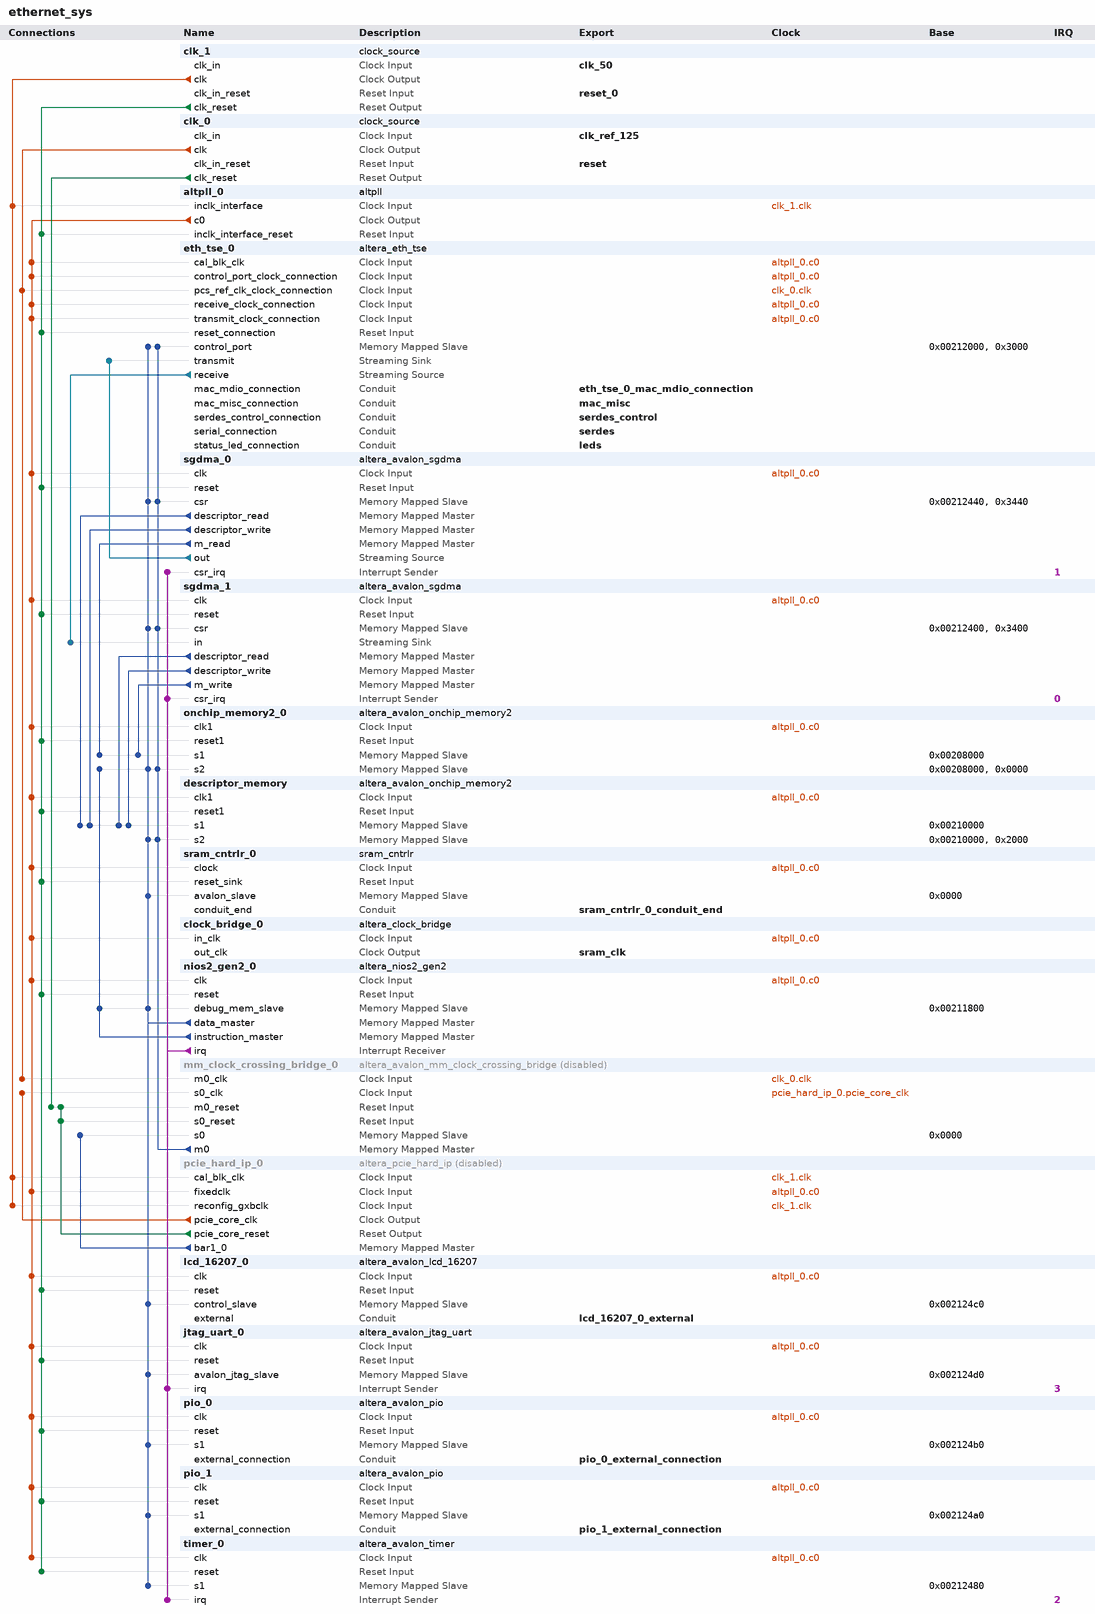
[diagram p0: system contents]
# Platform Designer (Qsys) system ethernet_sys, Cyclone IV GX EP4CGX15BF14C6
# Parameters at their usual value, and those the tool derives, are not listed.
package require -exact qsys 18.1
create_system ethernet_sys
set_project_property DEVICE_FAMILY {Cyclone IV GX}
set_project_property DEVICE EP4CGX15BF14C6

add_instance clk_1 clock_source 18.1
set_instance_parameter_value clk_1 clockFrequency 50000000

add_instance clk_0 clock_source 18.1
set_instance_parameter_value clk_0 clockFrequency 125000000

add_instance altpll_0 altpll 18.1
set_instance_parameter_value altpll_0 CLK0_DIVIDE_BY 1
set_instance_parameter_value altpll_0 CLK0_MULTIPLY_BY 2
set_instance_parameter_value altpll_0 INCLK0_INPUT_FREQUENCY 20000
set_instance_parameter_value altpll_0 PORT_ARESET PORT_UNUSED
set_instance_parameter_value altpll_0 PORT_LOCKED PORT_USED
set_instance_parameter_value altpll_0 PORT_clk1 PORT_UNUSED
set_instance_parameter_value altpll_0 PORT_clk2 PORT_UNUSED
set_instance_parameter_value altpll_0 PORT_clk3 PORT_UNUSED

add_instance eth_tse_0 altera_eth_tse 18.1
set_instance_parameter_value eth_tse_0 XCVR_RCFG_JTAG_ENABLE 0
set_instance_parameter_value eth_tse_0 XCVR_SET_CAPABILITY_REG_ENABLE 0
set_instance_parameter_value eth_tse_0 XCVR_SET_CSR_SOFT_LOGIC_ENABLE 0
set_instance_parameter_value eth_tse_0 XCVR_SET_PRBS_SOFT_LOGIC_ENABLE 0
set_instance_parameter_value eth_tse_0 XCVR_SET_USER_IDENTIFIER 0
set_instance_parameter_value eth_tse_0 core_variation MAC_PCS
set_instance_parameter_value eth_tse_0 eg_addr 9
set_instance_parameter_value eth_tse_0 enable_hd_logic false
set_instance_parameter_value eth_tse_0 enable_mac_flow_ctrl false
set_instance_parameter_value eth_tse_0 enable_magic_detect false
set_instance_parameter_value eth_tse_0 enable_shift16 true
set_instance_parameter_value eth_tse_0 ifGMII MII_GMII
set_instance_parameter_value eth_tse_0 ing_addr 11
set_instance_parameter_value eth_tse_0 mdio_clk_div 40
set_instance_parameter_value eth_tse_0 stat_cnt_ena false
set_instance_parameter_value eth_tse_0 transceiver_type GXB

add_instance sgdma_0 altera_avalon_sgdma 18.1
set_instance_parameter_value sgdma_0 enableBurstTransfers false
set_instance_parameter_value sgdma_0 enableUnalignedTransfers false
set_instance_parameter_value sgdma_0 readBlockDataWidth 32
set_instance_parameter_value sgdma_0 sinkErrorWidth 0
set_instance_parameter_value sgdma_0 sourceErrorWidth 0
set_instance_parameter_value sgdma_0 transferMode MEMORY_TO_STREAM
set_instance_parameter_value sgdma_0 writeBurstcountWidth 4

add_instance sgdma_1 altera_avalon_sgdma 18.1
set_instance_parameter_value sgdma_1 enableBurstTransfers false
set_instance_parameter_value sgdma_1 enableUnalignedTransfers false
set_instance_parameter_value sgdma_1 readBlockDataWidth 32
set_instance_parameter_value sgdma_1 sinkErrorWidth 0
set_instance_parameter_value sgdma_1 sourceErrorWidth 0
set_instance_parameter_value sgdma_1 transferMode STREAM_TO_MEMORY
set_instance_parameter_value sgdma_1 writeBurstcountWidth 4

add_instance onchip_memory2_0 altera_avalon_onchip_memory2 18.1
set_instance_parameter_value onchip_memory2_0 dataWidth 32
set_instance_parameter_value onchip_memory2_0 dualPort true
set_instance_parameter_value onchip_memory2_0 initMemContent true
set_instance_parameter_value onchip_memory2_0 initializationFileName C:/projects/quartus/ethernet/software/zhopen/mem_init/ethernet_sys_onchip_memory2_0.hex
set_instance_parameter_value onchip_memory2_0 memorySize 32768
set_instance_parameter_value onchip_memory2_0 singleClockOperation true
set_instance_parameter_value onchip_memory2_0 useNonDefaultInitFile true

add_instance descriptor_memory altera_avalon_onchip_memory2 18.1
set_instance_parameter_value descriptor_memory dataWidth 32
set_instance_parameter_value descriptor_memory dualPort true
set_instance_parameter_value descriptor_memory initMemContent true
set_instance_parameter_value descriptor_memory initializationFileName C:/projects/quartus/ethernet/software/zhopen/mem_init/ethernet_sys_descriptor_memory.hex
set_instance_parameter_value descriptor_memory memorySize 4096
set_instance_parameter_value descriptor_memory singleClockOperation true
set_instance_parameter_value descriptor_memory useNonDefaultInitFile true

add_instance sram_cntrlr_0 sram_cntrlr 1.0

add_instance clock_bridge_0 altera_clock_bridge 18.1
set_instance_parameter_value clock_bridge_0 DERIVED_CLOCK_RATE 100000000
set_instance_parameter_value clock_bridge_0 EXPLICIT_CLOCK_RATE 0

add_instance nios2_gen2_0 altera_nios2_gen2 18.1
set_instance_parameter_value nios2_gen2_0 dcache_size 2048
set_instance_parameter_value nios2_gen2_0 exceptionSlave onchip_memory2_0.s2
set_instance_parameter_value nios2_gen2_0 icache_size 4096
set_instance_parameter_value nios2_gen2_0 impl Tiny
set_instance_parameter_value nios2_gen2_0 resetSlave onchip_memory2_0.s2

add_instance mm_clock_crossing_bridge_0 altera_avalon_mm_clock_crossing_bridge 18.1
set_instance_property mm_clock_crossing_bridge_0 ENABLED false
set_instance_parameter_value mm_clock_crossing_bridge_0 ADDRESS_WIDTH 10
set_instance_parameter_value mm_clock_crossing_bridge_0 COMMAND_FIFO_DEPTH 4
set_instance_parameter_value mm_clock_crossing_bridge_0 DATA_WIDTH 32
set_instance_parameter_value mm_clock_crossing_bridge_0 MASTER_SYNC_DEPTH 2
set_instance_parameter_value mm_clock_crossing_bridge_0 MAX_BURST_SIZE 1
set_instance_parameter_value mm_clock_crossing_bridge_0 RESPONSE_FIFO_DEPTH 4
set_instance_parameter_value mm_clock_crossing_bridge_0 SLAVE_SYNC_DEPTH 2
set_instance_parameter_value mm_clock_crossing_bridge_0 USE_AUTO_ADDRESS_WIDTH 1

add_instance pcie_hard_ip_0 altera_pcie_hard_ip 18.1
set_instance_property pcie_hard_ip_0 ENABLED false
set_instance_parameter_value pcie_hard_ip_0 {BAR Type} {64 bit Prefetchable,Not used,Not used,Not used,Not used,Not used}
set_instance_parameter_value pcie_hard_ip_0 CB_A2P_ADDR_MAP_PASS_THRU_BITS 20
set_instance_parameter_value pcie_hard_ip_0 CB_PCIE_MODE 1
set_instance_parameter_value pcie_hard_ip_0 CB_PCIE_RX_LITE 1
set_instance_parameter_value pcie_hard_ip_0 CG_ENABLE_A2P_INTERRUPT 0
set_instance_parameter_value pcie_hard_ip_0 CG_IMPL_CRA_AV_SLAVE_PORT 0
set_instance_parameter_value pcie_hard_ip_0 CG_NO_CPL_REORDERING 0
set_instance_parameter_value pcie_hard_ip_0 {PCIe Address 31:0} 0x00000000,0x00000000,0x00000000,0x00000000,0x00000000,0x00000000,0x00000000,0x00000000,0x00000000,0x00000000,0x00000000,0x00000000,0x00000000,0x00000000,0x00000000,0x00000000
set_instance_parameter_value pcie_hard_ip_0 {PCIe Address 63:32} 0x00000000,0x00000000,0x00000000,0x00000000,0x00000000,0x00000000,0x00000000,0x00000000,0x00000000,0x00000000,0x00000000,0x00000000,0x00000000,0x00000000,0x00000000,0x00000000
set_instance_parameter_value pcie_hard_ip_0 class_code 16711680
set_instance_parameter_value pcie_hard_ip_0 device_id 2
set_instance_parameter_value pcie_hard_ip_0 my_advanced_errors false
set_instance_parameter_value pcie_hard_ip_0 my_enable_ecrc_check false
set_instance_parameter_value pcie_hard_ip_0 my_enable_ecrc_gen false
set_instance_parameter_value pcie_hard_ip_0 p_pcie_app_clk 1
set_instance_parameter_value pcie_hard_ip_0 p_pcie_target_performance_preset Medium
set_instance_parameter_value pcie_hard_ip_0 p_pcie_test_out_width None
set_instance_parameter_value pcie_hard_ip_0 p_pcie_txrx_clock {125 MHz}
set_instance_parameter_value pcie_hard_ip_0 p_user_msi_enable 0
set_instance_parameter_value pcie_hard_ip_0 revision_id 105
set_instance_parameter_value pcie_hard_ip_0 subsystem_device_id 2
set_instance_parameter_value pcie_hard_ip_0 subsystem_vendor_id 5827
set_instance_parameter_value pcie_hard_ip_0 vendor_id 5827

add_instance lcd_16207_0 altera_avalon_lcd_16207 18.1

add_instance jtag_uart_0 altera_avalon_jtag_uart 18.1
set_instance_parameter_value jtag_uart_0 simInteractiveOptions NO_INTERACTIVE_WINDOWS
set_instance_parameter_value jtag_uart_0 useRegistersForReadBuffer true
set_instance_parameter_value jtag_uart_0 useRegistersForWriteBuffer true

add_instance pio_0 altera_avalon_pio 18.1
set_instance_parameter_value pio_0 direction Input
set_instance_parameter_value pio_0 width 8

add_instance pio_1 altera_avalon_pio 18.1
set_instance_parameter_value pio_1 direction Output
set_instance_parameter_value pio_1 width 3

add_instance timer_0 altera_avalon_timer 18.1
set_instance_parameter_value timer_0 period 30
set_instance_parameter_value timer_0 periodUnits USEC

# connections
add_connection altpll_0.c0 clock_bridge_0.in_clk clock
add_connection altpll_0.c0 descriptor_memory.clk1 clock
add_connection altpll_0.c0 eth_tse_0.cal_blk_clk clock
add_connection altpll_0.c0 eth_tse_0.control_port_clock_connection clock
add_connection altpll_0.c0 eth_tse_0.receive_clock_connection clock
add_connection altpll_0.c0 eth_tse_0.transmit_clock_connection clock
add_connection altpll_0.c0 jtag_uart_0.clk clock
add_connection altpll_0.c0 lcd_16207_0.clk clock
add_connection altpll_0.c0 nios2_gen2_0.clk clock
add_connection altpll_0.c0 onchip_memory2_0.clk1 clock
add_connection altpll_0.c0 pcie_hard_ip_0.fixedclk clock
add_connection altpll_0.c0 pio_0.clk clock
add_connection altpll_0.c0 pio_1.clk clock
add_connection altpll_0.c0 sgdma_0.clk clock
add_connection altpll_0.c0 sgdma_1.clk clock
add_connection altpll_0.c0 sram_cntrlr_0.clock clock
add_connection altpll_0.c0 timer_0.clk clock
add_connection clk_0.clk eth_tse_0.pcs_ref_clk_clock_connection clock
add_connection clk_0.clk mm_clock_crossing_bridge_0.m0_clk clock
add_connection clk_1.clk altpll_0.inclk_interface clock
add_connection clk_1.clk pcie_hard_ip_0.cal_blk_clk clock
add_connection clk_1.clk pcie_hard_ip_0.reconfig_gxbclk clock
add_connection pcie_hard_ip_0.pcie_core_clk mm_clock_crossing_bridge_0.s0_clk clock
add_connection clk_0.clk_reset mm_clock_crossing_bridge_0.m0_reset reset
add_connection clk_1.clk_reset altpll_0.inclk_interface_reset reset
add_connection clk_1.clk_reset descriptor_memory.reset1 reset
add_connection clk_1.clk_reset eth_tse_0.reset_connection reset
add_connection clk_1.clk_reset jtag_uart_0.reset reset
add_connection clk_1.clk_reset lcd_16207_0.reset reset
add_connection clk_1.clk_reset nios2_gen2_0.reset reset
add_connection clk_1.clk_reset onchip_memory2_0.reset1 reset
add_connection clk_1.clk_reset pio_0.reset reset
add_connection clk_1.clk_reset pio_1.reset reset
add_connection clk_1.clk_reset sgdma_0.reset reset
add_connection clk_1.clk_reset sgdma_1.reset reset
add_connection clk_1.clk_reset sram_cntrlr_0.reset_sink reset
add_connection clk_1.clk_reset timer_0.reset reset
add_connection pcie_hard_ip_0.pcie_core_reset mm_clock_crossing_bridge_0.m0_reset reset
add_connection pcie_hard_ip_0.pcie_core_reset mm_clock_crossing_bridge_0.s0_reset reset
add_connection mm_clock_crossing_bridge_0.m0 descriptor_memory.s2 avalon
set_connection_parameter_value mm_clock_crossing_bridge_0.m0/descriptor_memory.s2 baseAddress 0x2000
add_connection mm_clock_crossing_bridge_0.m0 eth_tse_0.control_port avalon
set_connection_parameter_value mm_clock_crossing_bridge_0.m0/eth_tse_0.control_port baseAddress 0x3000
add_connection mm_clock_crossing_bridge_0.m0 onchip_memory2_0.s2 avalon
set_connection_parameter_value mm_clock_crossing_bridge_0.m0/onchip_memory2_0.s2 baseAddress 0x0000
add_connection mm_clock_crossing_bridge_0.m0 sgdma_0.csr avalon
set_connection_parameter_value mm_clock_crossing_bridge_0.m0/sgdma_0.csr baseAddress 0x3440
add_connection mm_clock_crossing_bridge_0.m0 sgdma_1.csr avalon
set_connection_parameter_value mm_clock_crossing_bridge_0.m0/sgdma_1.csr baseAddress 0x3400
add_connection nios2_gen2_0.data_master descriptor_memory.s2 avalon
set_connection_parameter_value nios2_gen2_0.data_master/descriptor_memory.s2 baseAddress 0x00210000
add_connection nios2_gen2_0.data_master eth_tse_0.control_port avalon
set_connection_parameter_value nios2_gen2_0.data_master/eth_tse_0.control_port baseAddress 0x00212000
add_connection nios2_gen2_0.data_master jtag_uart_0.avalon_jtag_slave avalon
set_connection_parameter_value nios2_gen2_0.data_master/jtag_uart_0.avalon_jtag_slave baseAddress 0x002124d0
add_connection nios2_gen2_0.data_master lcd_16207_0.control_slave avalon
set_connection_parameter_value nios2_gen2_0.data_master/lcd_16207_0.control_slave baseAddress 0x002124c0
add_connection nios2_gen2_0.data_master nios2_gen2_0.debug_mem_slave avalon
set_connection_parameter_value nios2_gen2_0.data_master/nios2_gen2_0.debug_mem_slave baseAddress 0x00211800
add_connection nios2_gen2_0.data_master onchip_memory2_0.s2 avalon
set_connection_parameter_value nios2_gen2_0.data_master/onchip_memory2_0.s2 baseAddress 0x00208000
add_connection nios2_gen2_0.data_master pio_0.s1 avalon
set_connection_parameter_value nios2_gen2_0.data_master/pio_0.s1 baseAddress 0x002124b0
add_connection nios2_gen2_0.data_master pio_1.s1 avalon
set_connection_parameter_value nios2_gen2_0.data_master/pio_1.s1 baseAddress 0x002124a0
add_connection nios2_gen2_0.data_master sgdma_0.csr avalon
set_connection_parameter_value nios2_gen2_0.data_master/sgdma_0.csr baseAddress 0x00212440
add_connection nios2_gen2_0.data_master sgdma_1.csr avalon
set_connection_parameter_value nios2_gen2_0.data_master/sgdma_1.csr baseAddress 0x00212400
add_connection nios2_gen2_0.data_master sram_cntrlr_0.avalon_slave avalon
set_connection_parameter_value nios2_gen2_0.data_master/sram_cntrlr_0.avalon_slave baseAddress 0x0000
add_connection nios2_gen2_0.data_master timer_0.s1 avalon
set_connection_parameter_value nios2_gen2_0.data_master/timer_0.s1 baseAddress 0x00212480
add_connection nios2_gen2_0.instruction_master nios2_gen2_0.debug_mem_slave avalon
set_connection_parameter_value nios2_gen2_0.instruction_master/nios2_gen2_0.debug_mem_slave baseAddress 0x00211800
add_connection nios2_gen2_0.instruction_master onchip_memory2_0.s2 avalon
set_connection_parameter_value nios2_gen2_0.instruction_master/onchip_memory2_0.s2 baseAddress 0x00208000
add_connection pcie_hard_ip_0.bar1_0 mm_clock_crossing_bridge_0.s0 avalon
set_connection_parameter_value pcie_hard_ip_0.bar1_0/mm_clock_crossing_bridge_0.s0 baseAddress 0x0000
add_connection sgdma_0.descriptor_read descriptor_memory.s1 avalon
set_connection_parameter_value sgdma_0.descriptor_read/descriptor_memory.s1 baseAddress 0x00210000
add_connection sgdma_0.descriptor_write descriptor_memory.s1 avalon
set_connection_parameter_value sgdma_0.descriptor_write/descriptor_memory.s1 baseAddress 0x00210000
add_connection sgdma_0.m_read onchip_memory2_0.s1 avalon
set_connection_parameter_value sgdma_0.m_read/onchip_memory2_0.s1 baseAddress 0x00208000
add_connection sgdma_1.descriptor_read descriptor_memory.s1 avalon
set_connection_parameter_value sgdma_1.descriptor_read/descriptor_memory.s1 baseAddress 0x00210000
add_connection sgdma_1.descriptor_write descriptor_memory.s1 avalon
set_connection_parameter_value sgdma_1.descriptor_write/descriptor_memory.s1 baseAddress 0x00210000
add_connection sgdma_1.m_write onchip_memory2_0.s1 avalon
set_connection_parameter_value sgdma_1.m_write/onchip_memory2_0.s1 baseAddress 0x00208000
add_connection eth_tse_0.receive sgdma_1.in avalon_streaming
add_connection sgdma_0.out eth_tse_0.transmit avalon_streaming
add_connection nios2_gen2_0.irq jtag_uart_0.irq interrupt
set_connection_parameter_value nios2_gen2_0.irq/jtag_uart_0.irq irqNumber 3
add_connection nios2_gen2_0.irq sgdma_0.csr_irq interrupt
set_connection_parameter_value nios2_gen2_0.irq/sgdma_0.csr_irq irqNumber 1
add_connection nios2_gen2_0.irq sgdma_1.csr_irq interrupt
set_connection_parameter_value nios2_gen2_0.irq/sgdma_1.csr_irq irqNumber 0
add_connection nios2_gen2_0.irq timer_0.irq interrupt
set_connection_parameter_value nios2_gen2_0.irq/timer_0.irq irqNumber 2

# exported interfaces
add_interface clk_50 clock sink
set_interface_property clk_50 EXPORT_OF clk_1.clk_in
add_interface clk_ref_125 clock sink
set_interface_property clk_ref_125 EXPORT_OF clk_0.clk_in
add_interface eth_tse_0_mac_mdio_connection conduit end
set_interface_property eth_tse_0_mac_mdio_connection EXPORT_OF eth_tse_0.mac_mdio_connection
add_interface lcd_16207_0_external conduit end
set_interface_property lcd_16207_0_external EXPORT_OF lcd_16207_0.external
add_interface leds conduit end
set_interface_property leds EXPORT_OF eth_tse_0.status_led_connection
add_interface mac_misc conduit end
set_interface_property mac_misc EXPORT_OF eth_tse_0.mac_misc_connection
add_interface pio_0_external_connection conduit end
set_interface_property pio_0_external_connection EXPORT_OF pio_0.external_connection
add_interface pio_1_external_connection conduit end
set_interface_property pio_1_external_connection EXPORT_OF pio_1.external_connection
add_interface reset reset sink
set_interface_property reset EXPORT_OF clk_0.clk_in_reset
add_interface reset_0 reset sink
set_interface_property reset_0 EXPORT_OF clk_1.clk_in_reset
add_interface serdes conduit end
set_interface_property serdes EXPORT_OF eth_tse_0.serial_connection
add_interface serdes_control conduit end
set_interface_property serdes_control EXPORT_OF eth_tse_0.serdes_control_connection
add_interface sram_clk clock source
set_interface_property sram_clk EXPORT_OF clock_bridge_0.out_clk
add_interface sram_cntrlr_0_conduit_end conduit end
set_interface_property sram_cntrlr_0_conduit_end EXPORT_OF sram_cntrlr_0.conduit_end

set_interconnect_requirement {$system} qsys_mm.clockCrossingAdapter HANDSHAKE
set_interconnect_requirement {$system} qsys_mm.enableEccProtection FALSE
set_interconnect_requirement {$system} qsys_mm.insertDefaultSlave FALSE
set_interconnect_requirement {$system} qsys_mm.maxAdditionalLatency 1

save_system ethernet_sys.qsys
